# EAGLE design shield (EAGLE 9.2.0)
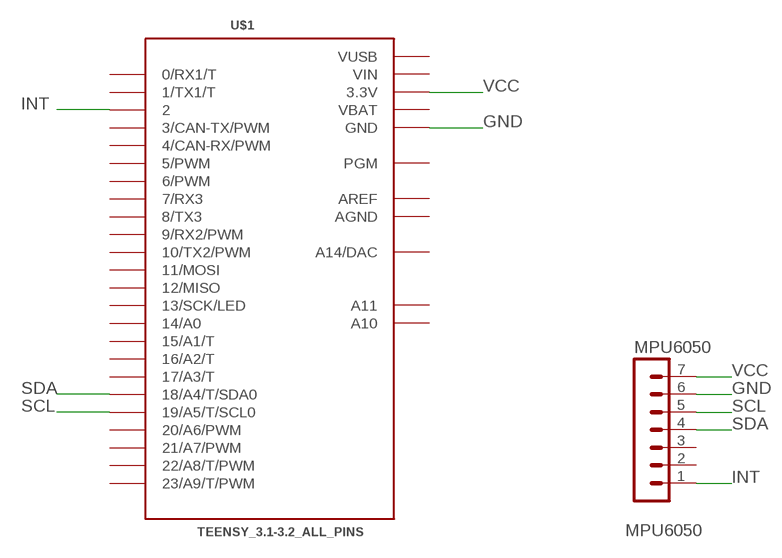
[diagram p0: schematic, sheet 1]

## Parts
MPU6050  MA07-1  [MA07-1]
U$1  TEENSY_3.1-3.2_ALL_PINS  [TEENSY_3.0-3.2&LC_ALL_PINS]

## Nets
GND: MPU6050.6 U$1.GND U$1.GND1(GND)
INT: MPU6050.1 U$1.2
SCL: MPU6050.5 U$1.19/A5(19/A5/T/SCL0)
SDA: MPU6050.4 U$1.18/A4(18/A4/T/SDA0)
VCC: MPU6050.7 U$1.3.3V U$1.3.3V1(3.3V)
Unconnected: MPU6050.2 MPU6050.3 U$1.0(0/RX1/T) U$1.1(1/TX1/T) U$1.3(3/CAN-TX/PWM) U$1.4(4/CAN-RX/PWM) U$1.5(5/PWM) U$1.6(6/PWM) U$1.7(7/RX3) U$1.8(8/TX3) U$1.9(9/RX2/PWM) U$1.10(10/TX2/PWM) U$1.11(11/MOSI) U$1.12(12/MISO) U$1.13(13/SCK/LED) U$1.14/A0 U$1.15/A1(15/A1/T) U$1.16/A2(16/A2/T) U$1.17/A3(17/A3/T) U$1.20/A6(20/A6/PWM) U$1.21/A7(21/A7/PWM) U$1.22/A8(22/A8/T/PWM) U$1.23/A9(23/A9/T/PWM) U$1.A10 U$1.A11 U$1.PGM U$1.RESET/DAC(A14/DAC)

## Notes on the sheet
- MPU6050

## Power pins joined to a net without a drawn wire
AGND: U$1.AGND
AREF: U$1.AREF
VBAT: U$1.VBAT
VIN: U$1.VIN
VUSB: U$1.VUSB

## Library data of the parts
MPU6050 = con-lstb:MA07-1: PIN HEADER; OC_FARNELL: unknown; OC_NEWARK: unknown
U$1 = Teensy:TEENSY_3.1-3.2_ALL_PINS: Footprint for Teensy 3.1 or 3.2 board using all through-holes, i.e. the entire perimeter plus the 4 through-holes inboard (A10,A11,AREF, VUSB)

## Board
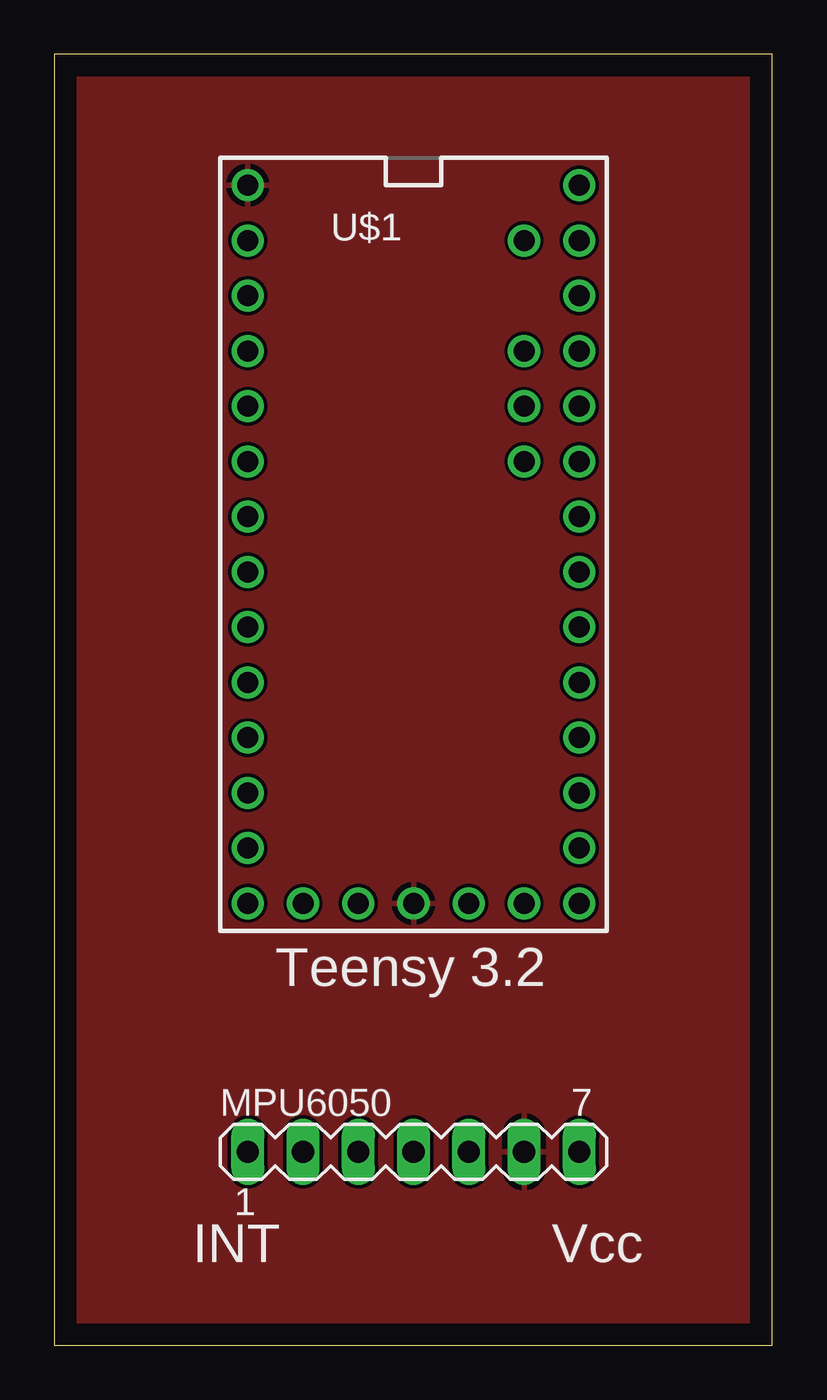
[diagram p1: board, top side]
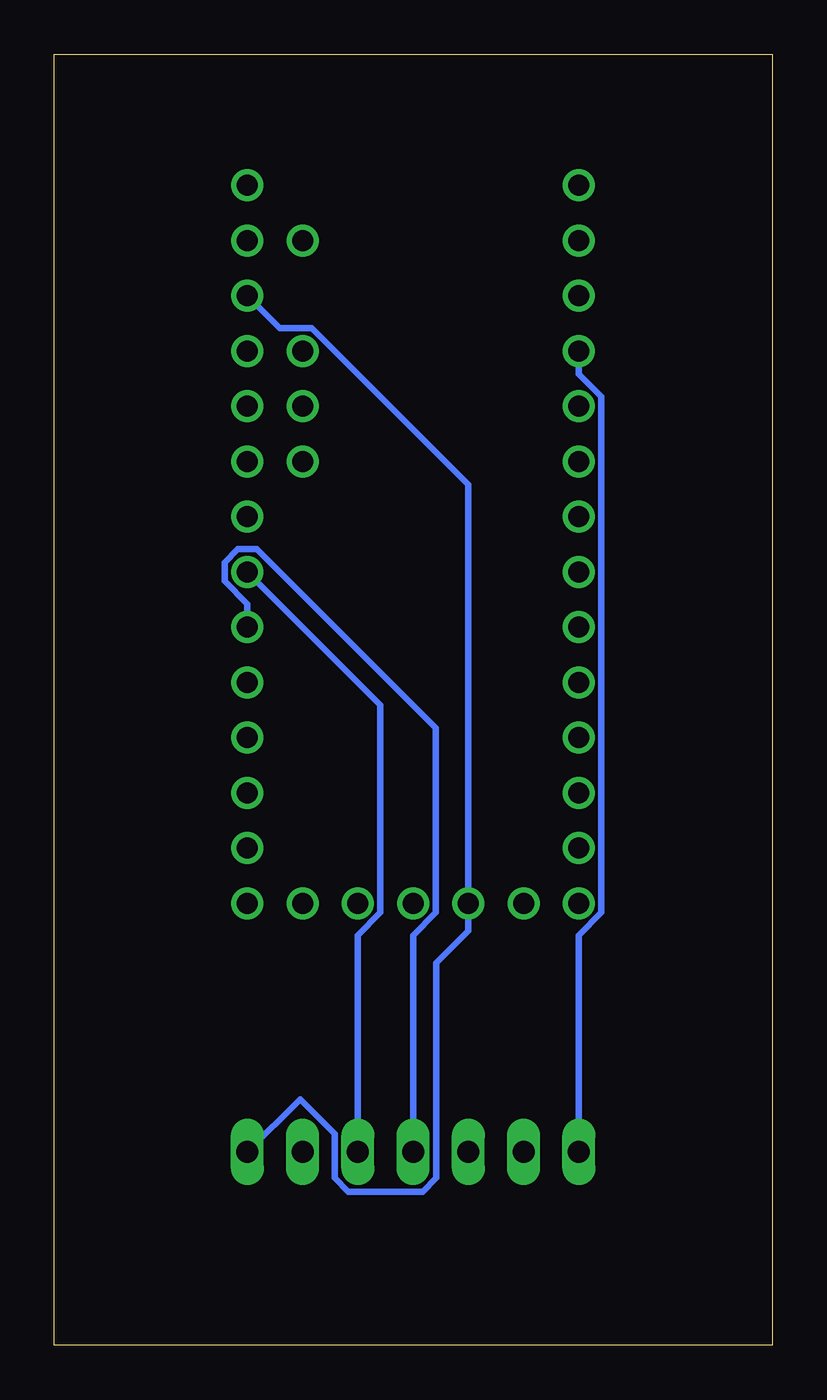
[diagram p2: board, bottom side, seen from below]

Size 33 x 59.36 mm. Coordinates in mm from the lower left corner, seen from the top.
Outline: 0,0 33,0 33,59.36 0,59.36 0,0
Copper layers (1*16): Top 0.035mm / dielectric 1.5mm / Bottom 0.035mm
Design rules "default": minimum track width 6mil, minimum drill 0.35mm, track to track 6mil, track to pad 6mil, pad to pad 6mil, via to via 6mil, smd to smd 6mil, copper to edge 40mil, drill to drill 6mil, minimum pad ring 10mil, minimum via ring 8mil, stop-mask expansion 4mil, vias tented up to drill 0mil, thermal gap 10mil

### Footprints (pad centres in the part's own frame; a part is rotated, then mirrored left to right if it is on the bottom)
MA07-1 = drill 1.016 long: 1 -7.62,0; 2 -5.08,0; 3 -2.54,0; 4 0,0; 5 2.54,0; 6 5.08,0; 7 7.62,0
TEENSY_3.0-3.2&LC_ALL_PINS = drill 0.965: 0 -7.62,13.97; 1 -7.62,11.43; 2 -7.62,8.89; 3 -7.62,6.35; 3.3V 7.62,11.43; 3.3V1 -2.54,-16.51; 4 -7.62,3.81; 5 -7.62,1.27; 6 -7.62,-1.27; 7 -7.62,-3.81; 8 -7.62,-6.35; 9 -7.62,-8.89; 10 -7.62,-11.43; 11 -7.62,-13.97; 12 -7.62,-16.51; 13 7.62,-16.51; 14/A0 7.62,-13.97; 15/A1 7.62,-11.43; 16/A2 7.62,-8.89; 17/A3 7.62,-6.35; 18/A4 7.62,-3.81; 19/A5 7.62,-1.27; 20/A6 7.62,1.27; 21/A7 7.62,3.81; 22/A8 7.62,6.35; 23/A9 7.62,8.89; A10 5.08,6.35; A11 5.08,3.81; AGND 7.62,13.97; AREF 5.08,8.89; GND -7.62,16.51; GND1 0,-16.51; PGM 2.54,-16.51; RESET/DAC 5.08,-16.51; VBAT -5.08,-16.51; VIN 7.62,16.51; VUSB 5.08,13.97

### Placement (x,y rotation side)
MPU6050  16.51,8.89 0 top
U$1  16.51,36.83 0 top

### Tracks (layer width: path | path; a pad name or v marks a point on that pad's centre or on a via)
GND
  pour Top: 0,58.42 33.02,58.42 33.02,0 0,0
INT
  Bottom 0.305: MPU6050.1 8.89,18.85 7.85,19.89 7.85,43.61 8.89,44.65 U$1.2
SCL
  Bottom 0.305: MPU6050.5 19.05,18.85 18.01,19.89 18.01,29.44 U$1.19/A5
SDA
  Bottom 0.305: MPU6050.4 16.51,18.85 15.47,19.89 15.47,28.37 23.7,36.6 24.56,36.6 25.17,35.99 25.17,35.13 24.13,34.09 U$1.18/A4
VCC
  Bottom 0.305: MPU6050.7 21.71,11.31 20.12,9.72 20.12,7.69 19.49,7.06 16.07,7.06 15.44,7.69 15.44,17.58 13.97,19.05 U$1.3.3V1 13.97,39.57 21.16,46.76 22.63,46.76 U$1.3.3V

### Text on the board
tPlace: Teensy 3.2 | INT | Vcc